# EAGLE design dcc (EAGLE 6.5.0)
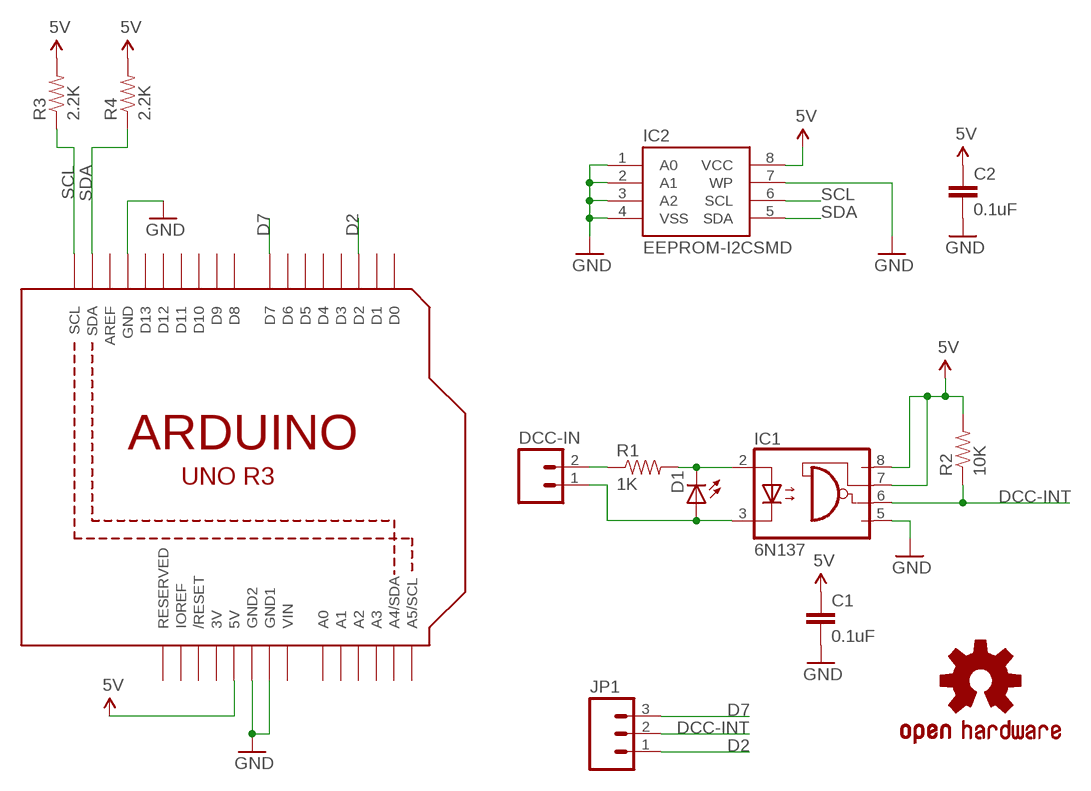
[diagram p0: schematic, sheet 1]

## Parts
C1  0.1uF  CAPPTH  [CAP-PTH-SMALL]
C2  0.1uF  0.1UF-25V(+80/-20%)(0603)  [0603-CAP]
D1  LED5MM  [LED5MM]
DCC-IN  M025MM  [SCREWTERMINAL-5MM-2]
IC1  6N137  [DIL08]
IC2  EEPROM-I2CSMD  [SO08]
JP1  M03PTH  [1X03]
LOGO1  OSHW-LOGOL  [OSHW-LOGO-L]
R1  1K  RESISTORPTH-1/4W  [AXIAL-0.4]
R2  10K  RESISTORPTH-1/4W  [AXIAL-0.4]
R3  2.2K  RESISTOR0603-RES  [0603-RES]
R4  2.2K  RESISTOR0603-RES  [0603-RES]
U1  ARDUINOR3-JUSTPINS  [ARDUINOR3]

## Nets
5V: C1.1 C2.1 IC1.7(VE) IC1.8(VCC) IC2.8(VCC) R2.P$2 R3.2 R4.2 U1.5V
D1: D1.K(C) IC1.2(A) R1.P$2
D2: JP1.1 U1.D2
D7: JP1.3 U1.D7
DCC-INT: IC1.6(VO) JP1.2 R2.P$1
GND: C1.2 C2.2 IC1.5(GND) IC2.1(A0) IC2.2(A1) IC2.3(A2) IC2.4(VSS) IC2.7(WP) U1.GND U1.GND1 U1.GND2
N$1: DCC-IN.2 R1.P$1
N$8: D1.A DCC-IN.1 IC1.3(C)
SCL: IC2.6(SCL) R3.1 U1.SCL
SDA: IC2.5(SDA) R4.1 U1.SDA
Unconnected: U1.A0 U1.A1 U1.A2 U1.A3 U1.A4(A4/SDA) U1.A5(A5/SCL) U1.AREF U1.D0 U1.D1 U1.D3 U1.D4 U1.D5 U1.D6 U1.D8 U1.D9 U1.D10 U1.D11 U1.D12 U1.D13 U1.IOREF U1.RESERVED U1.RESET(/RESET)

## Power pins joined to a net without a drawn wire
3V: U1.3V
VIN: U1.VIN

## Library data of the parts
C1 = SparkFun-Capacitors:CAP: Capacitor Standard 0603 ceramic capacitor, and 0.1" leaded capacitor.
C2 = SparkFun-Capacitors:0.1UF-25V(+80/-20%)(0603): CAP-00810 Ceramic Standard decoupling cap; PROD_ID: CAP-00810
D1 = adafruit:LED: LED OSRAM: - CHIPLED LG R971, LG N971, LY N971, LG Q971, LY Q971, LO R971, LY R971 LH N974, LH R974 LS Q976, LO Q976, LY Q976 LO Q996 - Hyper CHIPLED LW Q18S LB Q993, LB Q99A, LB R99A - SideLED LS A670, LO A670, LY A670, LG A670, LP A670 LB A673, LV A673, LT A673, LW A673 LH A674 LY A675 LS A676, LA A676, LO A676, LY A676, LW A676 LS A679, LY A679, LG A679 - Hyper Micro SIDELED® LS Y876, LA Y876, LO Y876, LY Y876 LT Y87S - SmartLED LW L88C, LW L88S LB L89C, LB L89S, LG L890 LS L89K, LO L89K, LY L89K LS L896, LA L896, LO L896, LY L896 - TOPLED LS T670, LO T670, LY T670, LG T670, LP T670 LSG T670, LSP T670, LSY T670, LOP T670, LYG T670 LG T671, LOG T671, LSG T671 LB T673, LV T673, LT T673, LW T673 LH T674 LS T676, LA T676, LO T676, LY T676, LB T676, LH T676, LSB T676, LW T676 LB T67C, LV T67C, LT T67C, LS T67K, LO T67K, LY T67K, LW E67C LS E67B, LA E67B, LO E67B, LY E67B, LB E67C, LV E67C, LT E67C LW T67C LS T679, LY T679, LG T679 LS T770, LO T770, LY T770, LG T770, LP T770 LB T773, LV T773, LT T773, LW T773 LH T774 LS E675, LA E675, LY E675, LS T675 LS T776, LA T776, LO T776, LY T776, LB T776 LHGB T686 LT T68C, LB T68C - Hyper Mini TOPLED® LB M676 - Mini TOPLED Santana® LG M470 LS M47K, LO M47K, LY M47K Source: http://www.osram.convergy.de/
DCC-IN = SparkFun-Connectors:M02: Standard 2-pin 0.1" header. Use with - straight break away headers ( PRT-00116) - right angle break away headers (PRT-00553) - swiss pins (PRT-00743) - machine pins (PRT-00117) - female headers (PRT-00115) Molex polarized connector foot print use with: PRT-08233 with associated crimp pins and housings. 2.54_SCREWTERM for use with PRT-10571. 3.5mm Screw Terminal footprints for PRT-08084 5mm Screw Terminal footprints for use with PRT-08433
IC1 = optocoupler:6N137: MOTOROLA OPTO COUPLER; MPN: 6N137; OC_FARNELL: 1328376; OC_NEWARK: 52M1895
IC2 = SparkFun-DigitalIC:EEPROM-I2C: I2C EEPROM chips, 24LC256 (and others)
JP1 = SparkFun-Connectors:M03: Header 3 Standard 3-pin 0.1" header. Use with straight break away headers (SKU : PRT-00116), right angle break away headers (PRT-00553), swiss pins (PRT-00743), machine pins (PRT-00117), and female headers (PRT-00115). Molex polarized connector foot print use with SKU : PRT-08232 with associated crimp pins and housings.
LOGO1 = SparkFun-Aesthetics:OSHW-LOGO: Open Source Hardware Logo This logo indicates the piece of hardware it is found on incorporates a OSHW license and/or adheres to the definition of open source hardware found here: http://freedomdefined.org/OSHW
R1-R4 = SparkFun-Passives:RESISTOR: Resistor Basic schematic elements and footprints for 0603, 1206, and PTH resistors.
U1 = arduino-pins:ARDUINOR3: This is a new object for the new Arduino R3 - with extra pins that you may want to use (such as IOref, and duplicated A4/A5

## Board
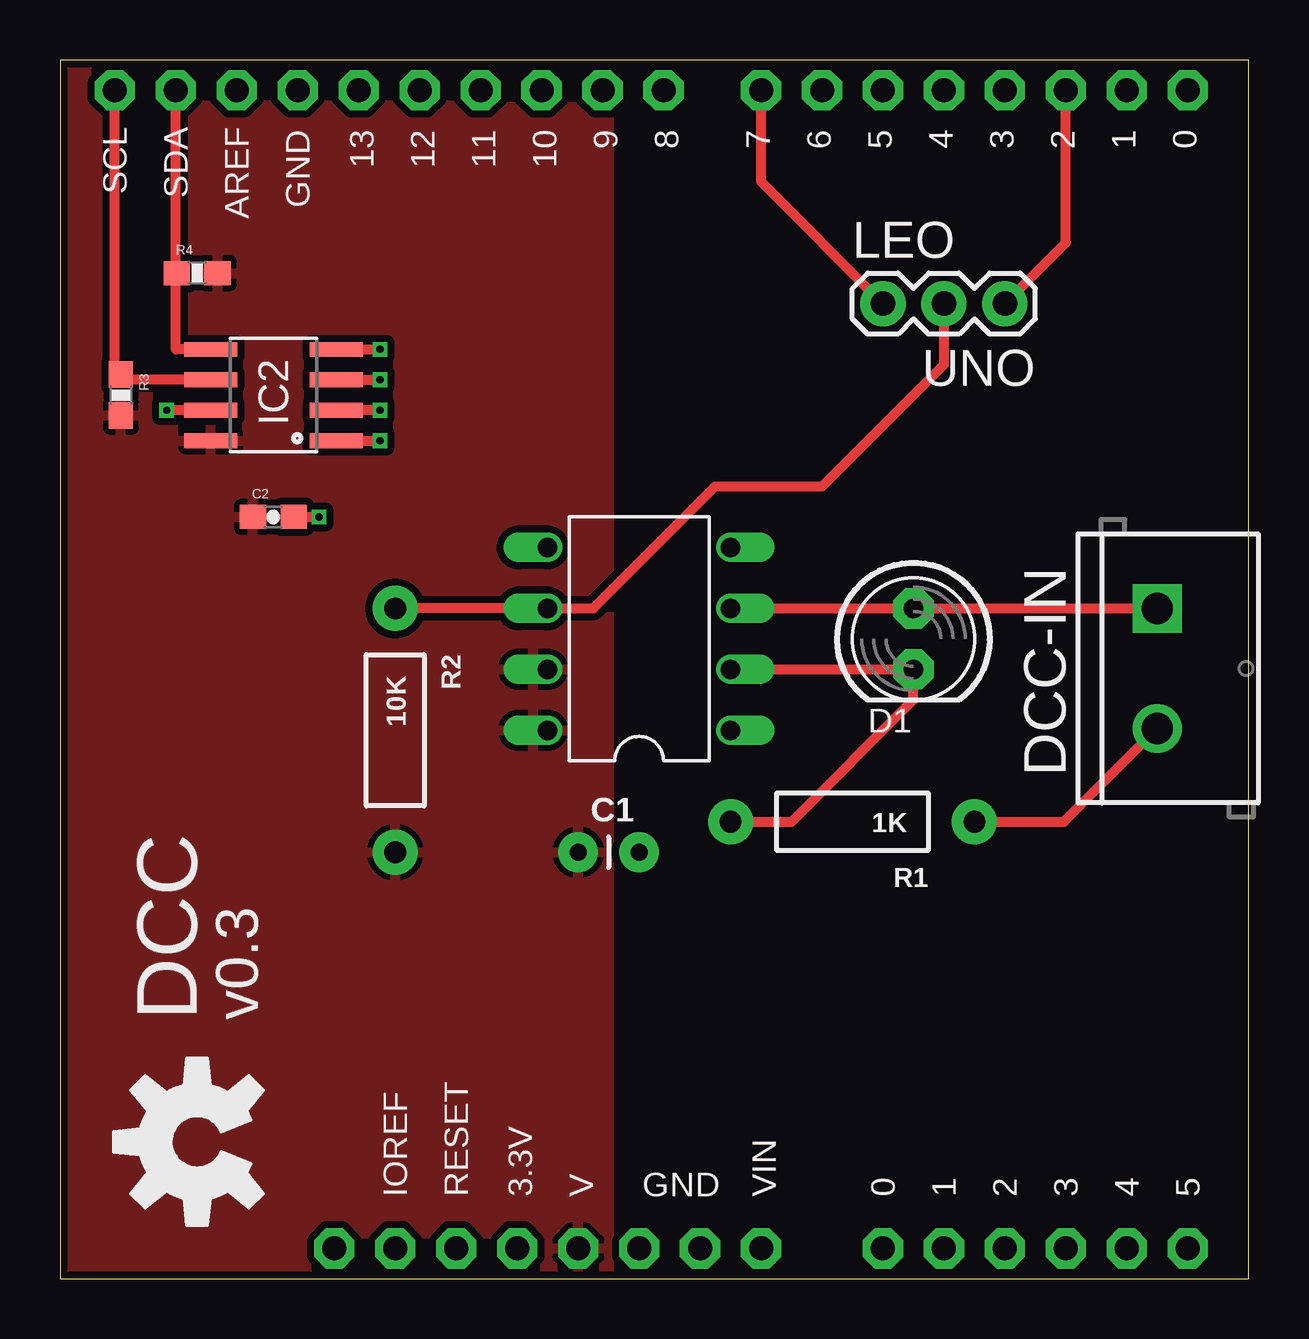
[diagram p1: board, top side]
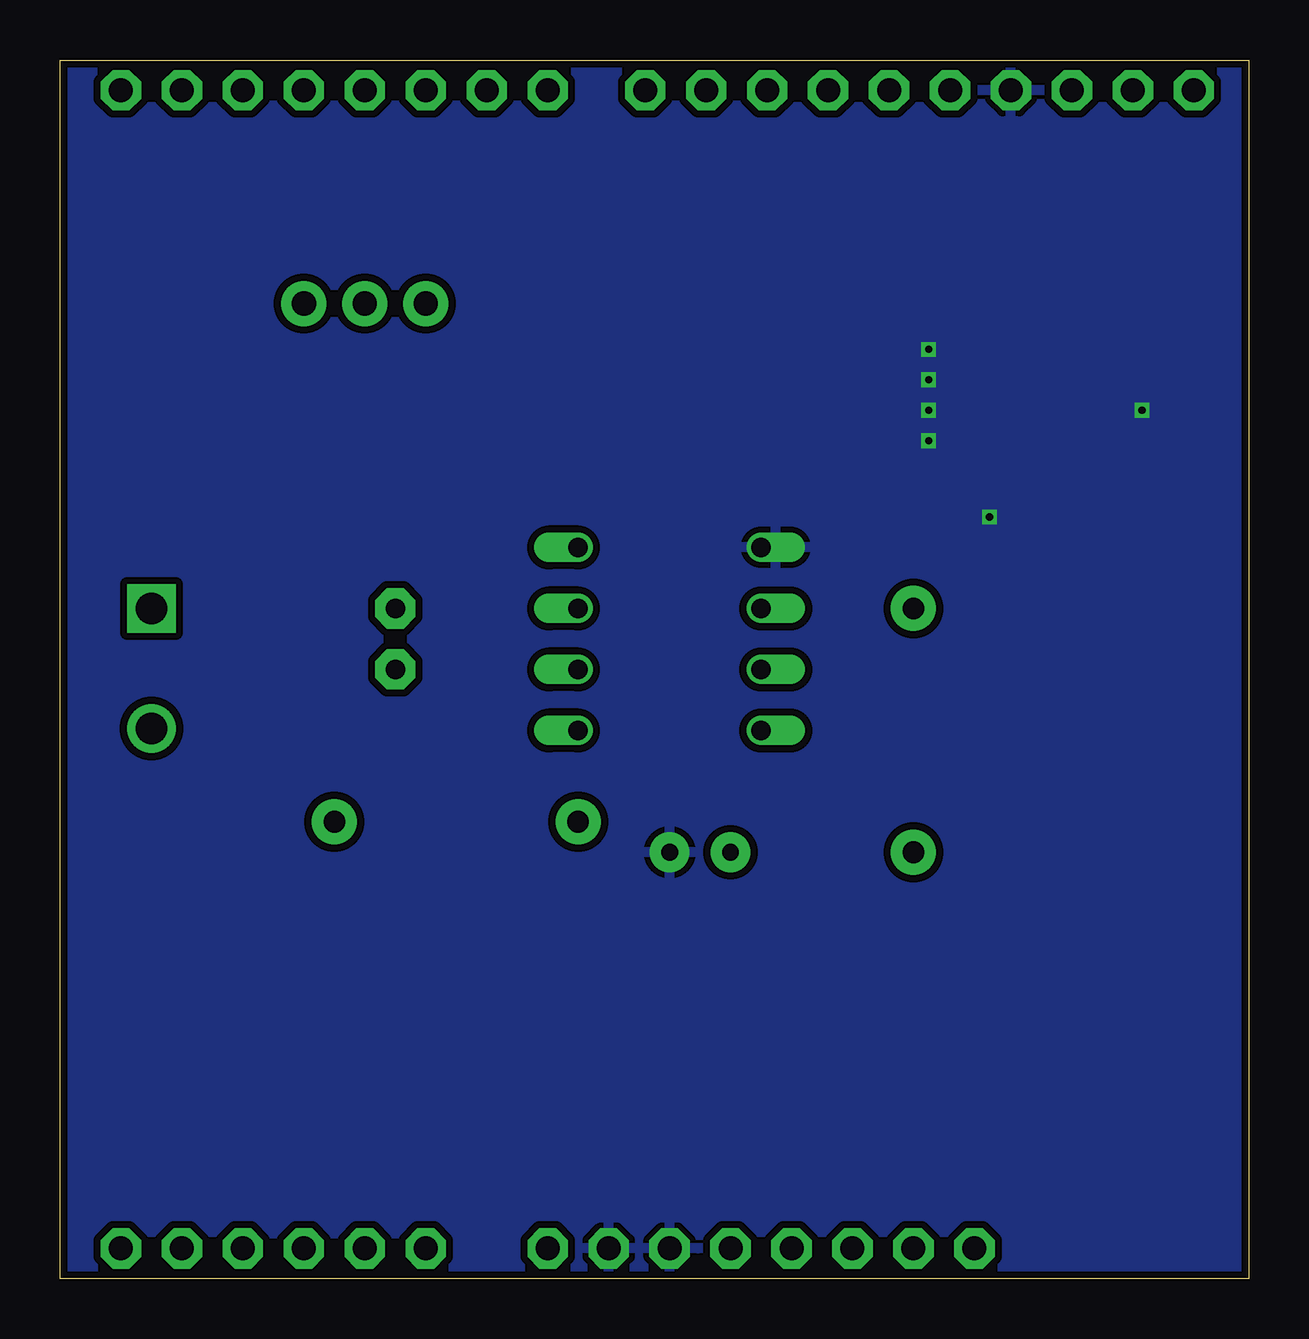
[diagram p2: board, bottom side, seen from below]

Size 49.53 x 50.79 mm. Coordinates in mm from the lower left corner, seen from the top.
Outline: 0,0 49.53,0 49.53,50.79 0,50.79 0,0
Copper layers (1*2*15*16): Top 0.035mm / dielectric 0.2mm / layer 2 0.0175mm / dielectric 1.1mm / layer 15 0.0175mm / dielectric 0.2mm / Bottom 0.035mm
Design rules "SeeedStudio_DRU_no_angle_20130527": minimum track width 6mil, minimum drill 12mil, track to track 6mil, track to pad 6mil, pad to pad 6mil, via to via 6mil, smd to smd 0mil, copper to edge 10mil, drill to drill 10mil, minimum pad ring 6mil, minimum via ring 6mil, stop-mask expansion 2mil, vias tented up to drill 25mil, thermal gap 10mil

### Footprints (pad centres in the part's own frame; a part is rotated, then mirrored left to right if it is on the bottom)
CAP-PTH-SMALL = drill 0.7 pad 1.651: 1 0,0; 2 2.54,0
0603-CAP = smd 1.1 x 1: 1 -0.85,0; 2 0.85,0
LED5MM = drill 0.813 pad 1.676 octagon: A -1.27,0; K 1.27,0
SCREWTERMINAL-5MM-2 = drill 1.3 pad 2.032 square: 1 0,0 | drill 1.3 pad 2.032: 2 5,0
DIL08 = drill 0.813 offset: 1 -3.81,-3.81; 2 -1.27,-3.81; 3 1.27,-3.81; 4 3.81,-3.81; 5 3.81,3.81; 6 1.27,3.81; 7 -1.27,3.81; 8 -3.81,3.81
SO08 = smd 0.61 x 2.21: 1 -1.905,-2.616; 2 -0.635,-2.616; 3 0.635,-2.616; 4 1.905,-2.616; 5 1.905,2.616; 6 0.635,2.616; 7 -0.635,2.616; 8 -1.905,2.616
1X03 = drill 1.016 pad 1.88: 1 0,0; 2 2.54,0; 3 5.08,0
AXIAL-0.4 = drill 0.9 pad 1.88: P$1 -5.08,0; P$2 5.08,0
0603-RES = smd 1.1 x 1: 1 -0.85,0; 2 0.85,0
ARDUINOR3 = drill 1 pad 1.676 octagon: 3V 19.05,1.27; 5V 21.59,1.27; A0 34.29,1.27; A1 36.83,1.27; A2 39.37,1.27; A3 41.91,1.27; A4 44.45,1.27; A5 46.99,1.27; AREF 7.366,49.53; D0 46.99,49.53; D1 44.45,49.53; D2 41.91,49.53; D3 39.37,49.53; D4 36.83,49.53; D5 34.29,49.53; D6 31.75,49.53; D7 29.21,49.53; D8 25.146,49.53; D9 22.606,49.53; D10 20.066,49.53; D11 17.526,49.53; D12 14.986,49.53; D13 12.446,49.53; GND 9.906,49.53; GND1 26.67,1.27; GND2 24.13,1.27; IOREF 13.97,1.27; RESERVED 11.43,1.27; RESET 16.51,1.27; SCL 2.286,49.53; SDA 4.826,49.53; VIN 29.21,1.27

### Placement (x,y rotation side)
C1  21.59,17.78 0 top
C2  8.89,31.75 0 top
D1  35.56,26.67 270 top
DCC-IN  45.72,27.94 270 top
IC1  24.13,26.67 90 top
IC2  8.89,36.83 90 top
JP1  39.37,40.64 180 top
LOGO1  5.71,5.71 90 top
R1  33.02,19.05 180 top
R2  13.97,22.86 270 top
R3  2.54,36.83 270 top
R4  5.71,41.91 0 top
U1  0,0 0 top

### Tracks (layer width: path | path; a pad name or v marks a point on that pad's centre or on a via)
5V
  pour Top (isolate 0.305): 0,0 0,50.8 22.86,50.8 22.86,0
D1
  Top 0.406: IC1.2 D1.K 35.56,24.13 30.48,19.05 R1.P$2
D2
  Top 0.406: JP1.1 41.91,43.18 U1.D2
D7
  Top 0.406: JP1.3 29.21,45.72 U1.D7
DCC-INT
  Top 0.406: R2.P$1 IC1.6 22.23,27.94 27.3,33.02 31.75,33.02 36.83,38.1 JP1.2
GND  (via drill 0.3)
  Top 0.406: v13.34,36.2 IC2.2 | IC2.3 v13.34,37.47 | IC2.4 v13.34,38.73 | IC2.7 v4.45,36.2 | C2.2 v10.79,31.75 | IC2.1 v13.34,34.92
  pour Bottom (isolate 0.305): 0,0 0,50.8 49.53,50.8 49.53,0
N$1
  Top 0.406: R1.P$1 41.83,19.05 DCC-IN.2
N$8
  Top 0.406: IC1.3 D1.A DCC-IN.1
SCL
  Top 0.406: IC2.6 2.29,37.47 2.29,37.68 | 2.29,37.68 U1.SCL | R3.1 2.29,37.68
SDA
  Top 0.406: IC2.5 4.83,38.73 4.83,41.91 | 4.83,41.91 U1.SDA | R4.1 4.83,41.91

### Text on the board
tPlace: LEO | UNO | DCC | v0.3